# Altium schematic sheet vout.SchDoc: Vout
size A3; Author: wq; DrawnBy: wq; Organization: 合肥弗雷电子; Address1: 玉兰大道14号D栋3楼; Address2: 肥西县桃花镇; Address3: 合肥市; Address4: 安徽省; DocumentNumber: 1; Revision: betaV1.0; SheetNumber: 1; SheetTotal: 1
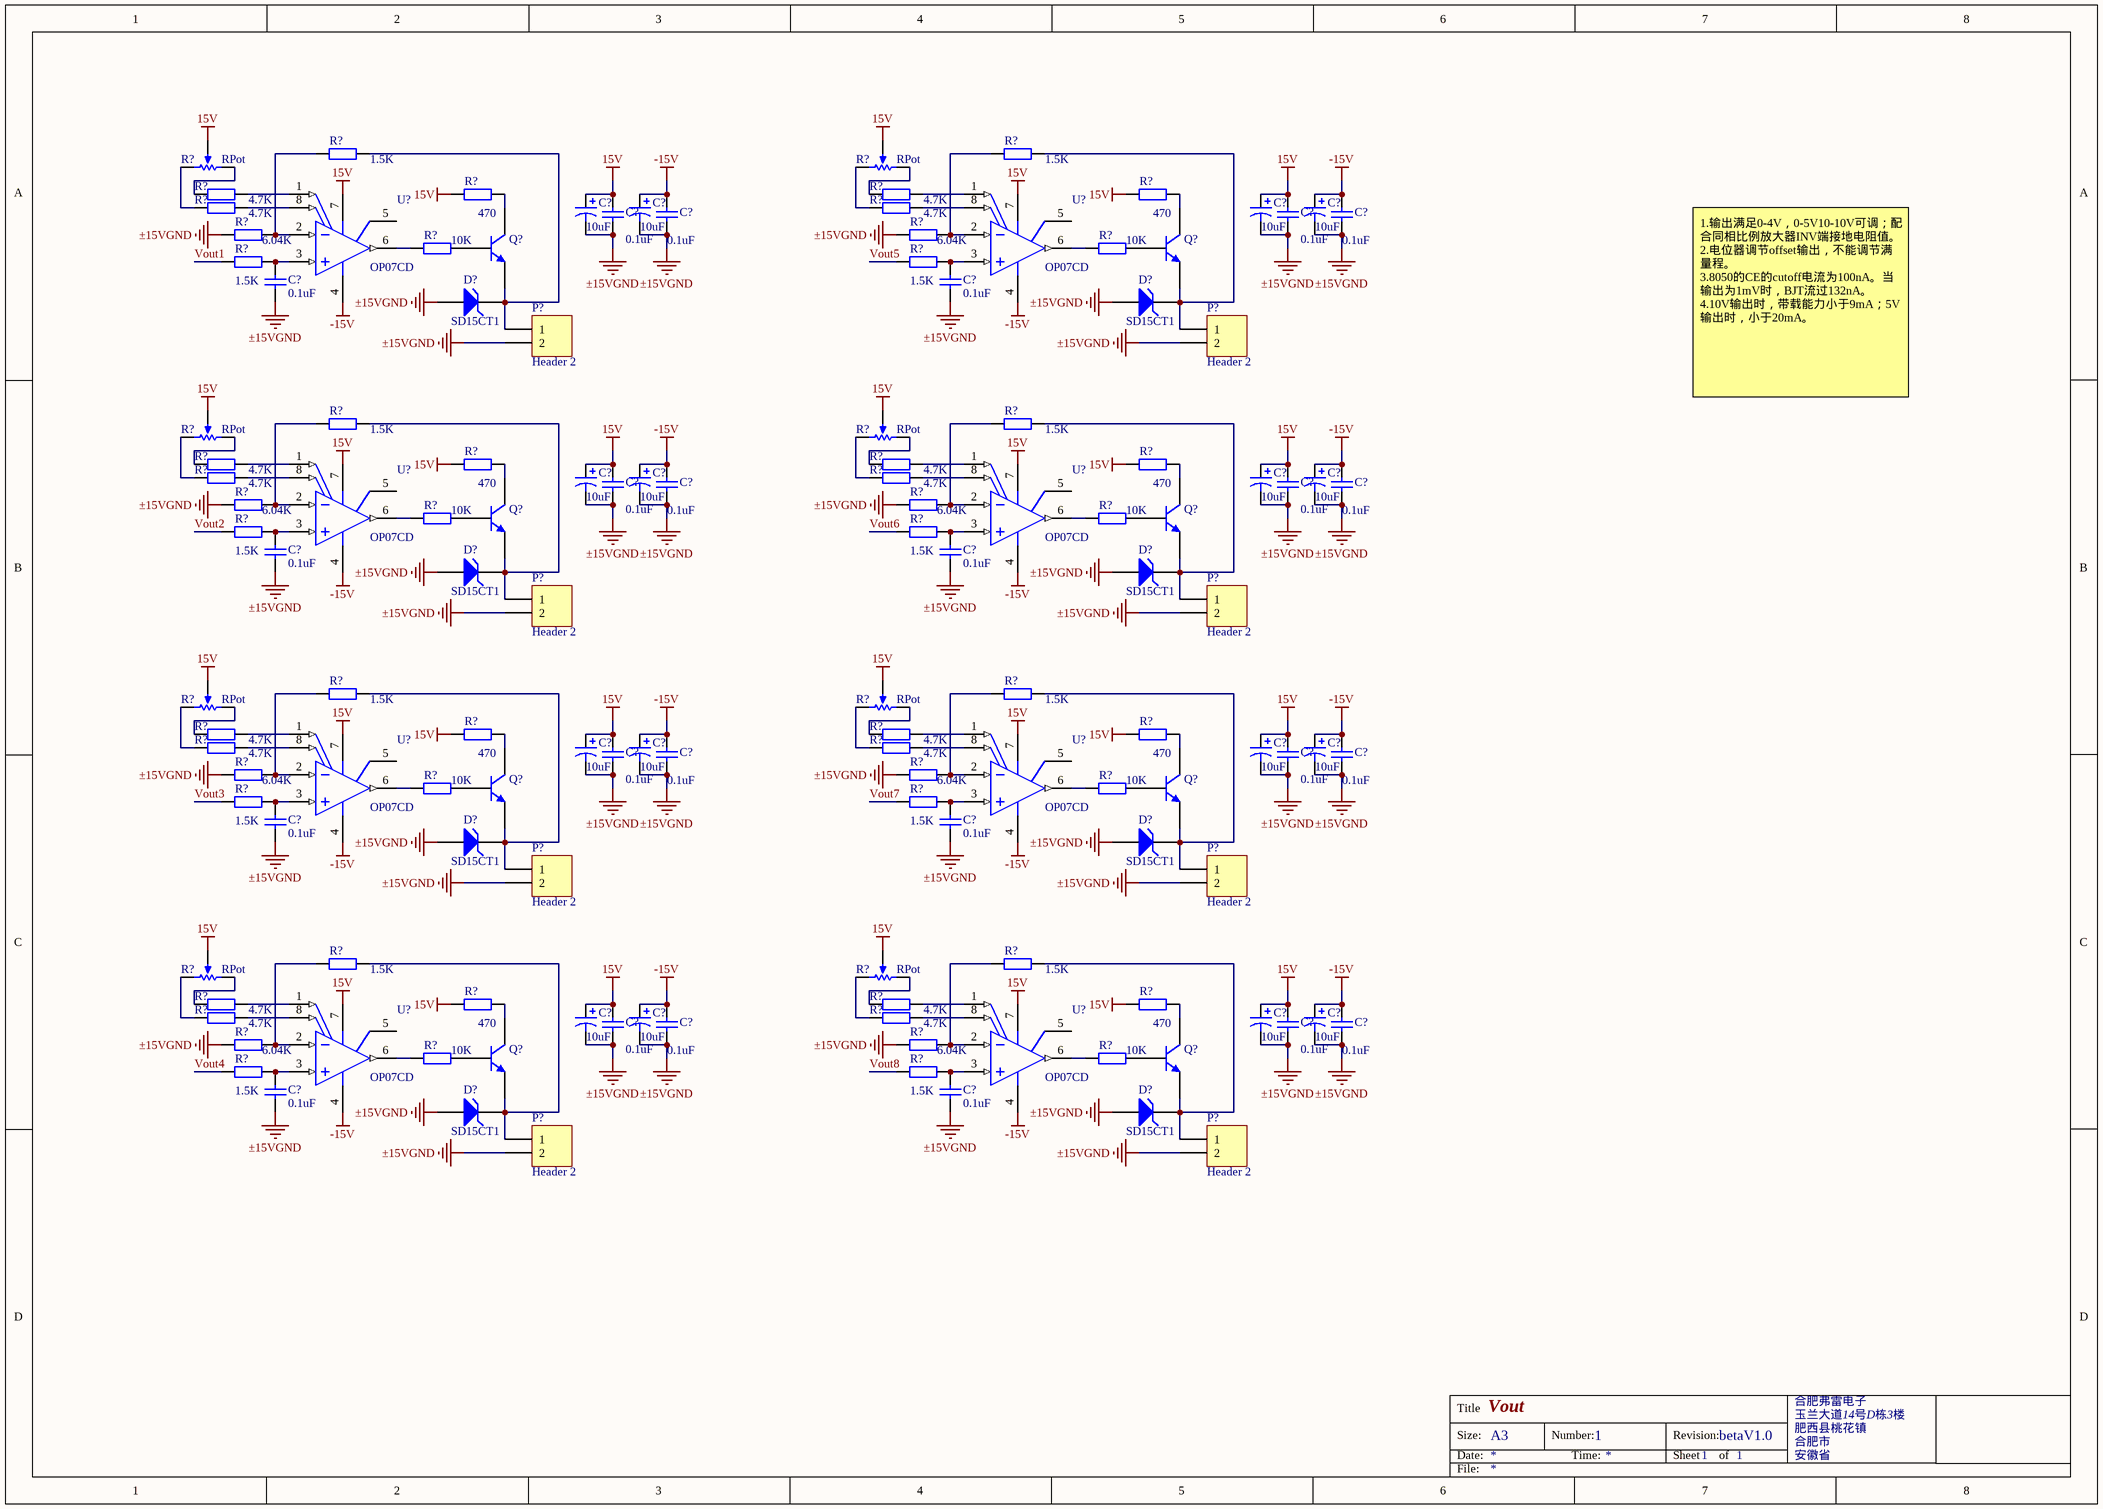
[diagram p0: vout.SchDoc]

## Parts
(Parts that share a designator on the sheet are numbered #1, #2 ... from top to bottom, then left to right.)
C?#1  value 10uF  [CB]  (hidden comment: T494B106M025AHAUTO)
C?#2  value 10uF  [CB]  (hidden comment: T494B106M025AHAUTO)
C?#3  value 10uF  [CB]  (hidden comment: T494B106M025AHAUTO)
C?#4  value 10uF  [CB]  (hidden comment: T494B106M025AHAUTO)
C?#5  value 0.1uF  [0805c]  (hidden comment: CC0805MRX7R9BB104)
C?#6  value 0.1uF  [0805c]  (hidden comment: CC0805MRX7R9BB104)
C?#7  value 0.1uF  [0805c]  (hidden comment: CC0805MRX7R9BB104)
C?#8  value 0.1uF  [0805c]  (hidden comment: CC0805MRX7R9BB104)
C?#9  value 0.1uF  [0805c]  (hidden comment: CC0805MRX7R9BB104)
C?#10  value 0.1uF  [0805c]  (hidden comment: CC0805MRX7R9BB104)
C?#11  value 10uF  [CB]  (hidden comment: T494B106M025AHAUTO)
C?#12  value 10uF  [CB]  (hidden comment: T494B106M025AHAUTO)
C?#13  value 10uF  [CB]  (hidden comment: T494B106M025AHAUTO)
C?#14  value 10uF  [CB]  (hidden comment: T494B106M025AHAUTO)
C?#15  value 0.1uF  [0805c]  (hidden comment: CC0805MRX7R9BB104)
C?#16  value 0.1uF  [0805c]  (hidden comment: CC0805MRX7R9BB104)
C?#17  value 0.1uF  [0805c]  (hidden comment: CC0805MRX7R9BB104)
C?#18  value 0.1uF  [0805c]  (hidden comment: CC0805MRX7R9BB104)
C?#19  value 0.1uF  [0805c]  (hidden comment: CC0805MRX7R9BB104)
C?#20  value 0.1uF  [0805c]  (hidden comment: CC0805MRX7R9BB104)
C?#21  value 10uF  [CB]  (hidden comment: T494B106M025AHAUTO)
C?#22  value 10uF  [CB]  (hidden comment: T494B106M025AHAUTO)
C?#23  value 10uF  [CB]  (hidden comment: T494B106M025AHAUTO)
C?#24  value 10uF  [CB]  (hidden comment: T494B106M025AHAUTO)
C?#25  value 0.1uF  [0805c]  (hidden comment: CC0805MRX7R9BB104)
C?#26  value 0.1uF  [0805c]  (hidden comment: CC0805MRX7R9BB104)
C?#27  value 0.1uF  [0805c]  (hidden comment: CC0805MRX7R9BB104)
C?#28  value 0.1uF  [0805c]  (hidden comment: CC0805MRX7R9BB104)
C?#29  value 0.1uF  [0805c]  (hidden comment: CC0805MRX7R9BB104)
C?#30  value 0.1uF  [0805c]  (hidden comment: CC0805MRX7R9BB104)
C?#31  value 10uF  [CB]  (hidden comment: T494B106M025AHAUTO)
C?#32  value 10uF  [CB]  (hidden comment: T494B106M025AHAUTO)
C?#33  value 10uF  [CB]  (hidden comment: T494B106M025AHAUTO)
C?#34  value 10uF  [CB]  (hidden comment: T494B106M025AHAUTO)
C?#35  value 0.1uF  [0805c]  (hidden comment: CC0805MRX7R9BB104)
C?#36  value 0.1uF  [0805c]  (hidden comment: CC0805MRX7R9BB104)
C?#37  value 0.1uF  [0805c]  (hidden comment: CC0805MRX7R9BB104)
C?#38  value 0.1uF  [0805c]  (hidden comment: CC0805MRX7R9BB104)
C?#39  value 0.1uF  [0805c]  (hidden comment: CC0805MRX7R9BB104)
C?#40  value 0.1uF  [0805c]  (hidden comment: CC0805MRX7R9BB104)
D?#1  SD15CT1  [sod323]
D?#2  SD15CT1  [sod323]
D?#3  SD15CT1  [sod323]
D?#4  SD15CT1  [sod323]
D?#5  SD15CT1  [sod323]
D?#6  SD15CT1  [sod323]
D?#7  SD15CT1  [sod323]
D?#8  SD15CT1  [sod323]
P?#1  Header 2  [HDR1X2]
P?#2  Header 2  [HDR1X2]
P?#3  Header 2  [HDR1X2]
P?#4  Header 2  [HDR1X2]
P?#5  Header 2  [HDR1X2]
P?#6  Header 2  [HDR1X2]
P?#7  Header 2  [HDR1X2]
P?#8  Header 2  [HDR1X2]
Q?#1  MMSS8050  [SOT-23-BJT]  (value not drawn)
Q?#2  MMSS8050  [SOT-23-BJT]  (value not drawn)
Q?#3  MMSS8050  [SOT-23-BJT]  (value not drawn)
Q?#4  MMSS8050  [SOT-23-BJT]  (value not drawn)
Q?#5  MMSS8050  [SOT-23-BJT]  (value not drawn)
Q?#6  MMSS8050  [SOT-23-BJT]  (value not drawn)
Q?#7  MMSS8050  [SOT-23-BJT]  (value not drawn)
Q?#8  MMSS8050  [SOT-23-BJT]  (value not drawn)
R?#1  RPot  [VR5]
R?#2  RPot  [VR5]
R?#3  value 1.5K  [0805R]  (hidden comment: RC0805JR-072KL)
R?#4  value 1.5K  [0805R]  (hidden comment: RC0805JR-072KL)
R?#5  value 470  [0805R]  (hidden comment: RC0805JR-07470RL)
R?#6  value 470  [0805R]  (hidden comment: RC0805JR-07470RL)
R?#7  value 4.7K  [0805R]  (hidden comment: RC0805JR-074700RL)
R?#8  value 4.7K  [0805R]  (hidden comment: RC0805JR-074700RL)
R?#9  value 4.7K  [0805R]  (hidden comment: RC0805JR-074700RL)
R?#10  value 4.7K  [0805R]  (hidden comment: RC0805JR-074700RL)
R?#11  value 6.04K  [0805R]  (hidden comment: RC0805JR-072KL)
R?#12  value 6.04K  [0805R]  (hidden comment: RC0805JR-072KL)
R?#13  value 10K  [0805R]  (hidden comment: RC0805JR-0710KL)
R?#14  value 10K  [0805R]  (hidden comment: RC0805JR-0710KL)
R?#15  value 1.5K  [0805R]  (hidden comment: RC0805JR-072KL)
R?#16  value 1.5K  [0805R]  (hidden comment: RC0805JR-072KL)
R?#17  RPot  [VR5]
R?#18  RPot  [VR5]
R?#19  value 1.5K  [0805R]  (hidden comment: RC0805JR-072KL)
R?#20  value 1.5K  [0805R]  (hidden comment: RC0805JR-072KL)
R?#21  value 470  [0805R]  (hidden comment: RC0805JR-07470RL)
R?#22  value 470  [0805R]  (hidden comment: RC0805JR-07470RL)
R?#23  value 4.7K  [0805R]  (hidden comment: RC0805JR-074700RL)
R?#24  value 4.7K  [0805R]  (hidden comment: RC0805JR-074700RL)
R?#25  value 4.7K  [0805R]  (hidden comment: RC0805JR-074700RL)
R?#26  value 4.7K  [0805R]  (hidden comment: RC0805JR-074700RL)
R?#27  value 6.04K  [0805R]  (hidden comment: RC0805JR-072KL)
R?#28  value 6.04K  [0805R]  (hidden comment: RC0805JR-072KL)
R?#29  value 10K  [0805R]  (hidden comment: RC0805JR-0710KL)
R?#30  value 10K  [0805R]  (hidden comment: RC0805JR-0710KL)
R?#31  value 1.5K  [0805R]  (hidden comment: RC0805JR-072KL)
R?#32  value 1.5K  [0805R]  (hidden comment: RC0805JR-072KL)
R?#33  RPot  [VR5]
R?#34  RPot  [VR5]
R?#35  value 1.5K  [0805R]  (hidden comment: RC0805JR-072KL)
R?#36  value 1.5K  [0805R]  (hidden comment: RC0805JR-072KL)
R?#37  value 470  [0805R]  (hidden comment: RC0805JR-07470RL)
R?#38  value 470  [0805R]  (hidden comment: RC0805JR-07470RL)
R?#39  value 4.7K  [0805R]  (hidden comment: RC0805JR-074700RL)
R?#40  value 4.7K  [0805R]  (hidden comment: RC0805JR-074700RL)
R?#41  value 4.7K  [0805R]  (hidden comment: RC0805JR-074700RL)
R?#42  value 4.7K  [0805R]  (hidden comment: RC0805JR-074700RL)
R?#43  value 6.04K  [0805R]  (hidden comment: RC0805JR-072KL)
R?#44  value 6.04K  [0805R]  (hidden comment: RC0805JR-072KL)
R?#45  value 10K  [0805R]  (hidden comment: RC0805JR-0710KL)
R?#46  value 10K  [0805R]  (hidden comment: RC0805JR-0710KL)
R?#47  value 1.5K  [0805R]  (hidden comment: RC0805JR-072KL)
R?#48  value 1.5K  [0805R]  (hidden comment: RC0805JR-072KL)
R?#49  RPot  [VR5]
R?#50  RPot  [VR5]
R?#51  value 1.5K  [0805R]  (hidden comment: RC0805JR-072KL)
R?#52  value 1.5K  [0805R]  (hidden comment: RC0805JR-072KL)
R?#53  value 470  [0805R]  (hidden comment: RC0805JR-07470RL)
R?#54  value 470  [0805R]  (hidden comment: RC0805JR-07470RL)
R?#55  value 4.7K  [0805R]  (hidden comment: RC0805JR-074700RL)
R?#56  value 4.7K  [0805R]  (hidden comment: RC0805JR-074700RL)
R?#57  value 4.7K  [0805R]  (hidden comment: RC0805JR-074700RL)
R?#58  value 4.7K  [0805R]  (hidden comment: RC0805JR-074700RL)
R?#59  value 6.04K  [0805R]  (hidden comment: RC0805JR-072KL)
R?#60  value 6.04K  [0805R]  (hidden comment: RC0805JR-072KL)
R?#61  value 10K  [0805R]  (hidden comment: RC0805JR-0710KL)
R?#62  value 10K  [0805R]  (hidden comment: RC0805JR-0710KL)
R?#63  value 1.5K  [0805R]  (hidden comment: RC0805JR-072KL)
R?#64  value 1.5K  [0805R]  (hidden comment: RC0805JR-072KL)
U?#1  OP07CD  [TI-D8_N]
U?#2  OP07CD  [TI-D8_N]
U?#3  OP07CD  [TI-D8_N]
U?#4  OP07CD  [TI-D8_N]
U?#5  OP07CD  [TI-D8_N]
U?#6  OP07CD  [TI-D8_N]
U?#7  OP07CD  [TI-D8_N]
U?#8  OP07CD  [TI-D8_N]

## Nets
15V: C?#1.1 C?#3.1 C?#5.2 C?#7.2 C?#11.1 C?#13.1 C?#15.2 C?#17.2 C?#21.1 C?#23.1 C?#25.2 C?#27.2 C?#31.1 C?#33.1 C?#35.2 C?#37.2 R?#1.2(TAP) R?#2.2(TAP) R?#5.1 R?#6.1 R?#17.2(TAP) R?#18.2(TAP) R?#21.1 R?#22.1 R?#33.2(TAP) R?#34.2(TAP) R?#37.1 R?#38.1 R?#49.2(TAP) R?#50.2(TAP) R?#53.1 R?#54.1 U?#1.7(VCC+) U?#2.7(VCC+) U?#3.7(VCC+) U?#4.7(VCC+) U?#5.7(VCC+) U?#6.7(VCC+) U?#7.7(VCC+) U?#8.7(VCC+)
-15V: C?#2.1 C?#4.1 C?#6.2 C?#8.2 C?#12.1 C?#14.1 C?#16.2 C?#18.2 C?#22.1 C?#24.1 C?#26.2 C?#28.2 C?#32.1 C?#34.1 C?#36.2 C?#38.2 U?#1.4(VCC-) U?#2.4(VCC-) U?#3.4(VCC-) U?#4.4(VCC-) U?#5.4(VCC-) U?#6.4(VCC-) U?#7.4(VCC-) U?#8.4(VCC-)
±15VGND: C?#1.2 C?#2.2 C?#3.2 C?#4.2 C?#5.1 C?#6.1 C?#7.1 C?#8.1 C?#9.2 C?#10.2 C?#11.2 C?#12.2 C?#13.2 C?#14.2 C?#15.1 C?#16.1 C?#17.1 C?#18.1 C?#19.2 C?#20.2 C?#21.2 C?#22.2 C?#23.2 C?#24.2 C?#25.1 C?#26.1 C?#27.1 C?#28.1 C?#29.2 C?#30.2 C?#31.2 C?#32.2 C?#33.2 C?#34.2 C?#35.1 C?#36.1 C?#37.1 C?#38.1 C?#39.2 C?#40.2 D?#1.1(A) D?#2.1(A) D?#3.1(A) D?#4.1(A) D?#5.1(A) D?#6.1(A) D?#7.1(A) D?#8.1(A) P?#1.2 P?#2.2 P?#3.2 P?#4.2 P?#5.2 P?#6.2 P?#7.2 P?#8.2 R?#11.2 R?#12.2 R?#27.2 R?#28.2 R?#43.2 R?#44.2 R?#59.2 R?#60.2
Vout1: R?#15.2
Vout2: R?#31.2
Vout3: R?#47.2
Vout4: R?#63.2
Vout5: R?#16.2
Vout6: R?#32.2
Vout7: R?#48.2
Vout8: R?#64.2
NetC?#9_1: C?#9.1 R?#15.1 U?#1.3(IN+)
NetC?#10_1: C?#10.1 R?#16.1 U?#2.3(IN+)
NetC?#19_1: C?#19.1 R?#31.1 U?#3.3(IN+)
NetC?#20_1: C?#20.1 R?#32.1 U?#4.3(IN+)
NetC?#29_1: C?#29.1 R?#47.1 U?#5.3(IN+)
NetC?#30_1: C?#30.1 R?#48.1 U?#6.3(IN+)
NetC?#39_1: C?#39.1 R?#63.1 U?#7.3(IN+)
NetC?#40_1: C?#40.1 R?#64.1 U?#8.3(IN+)
NetD?#1_2: D?#1.2(K) P?#1.1 Q?#1.3(E) R?#3.1
NetD?#2_2: D?#2.2(K) P?#2.1 Q?#2.3(E) R?#4.1
NetD?#3_2: D?#3.2(K) P?#3.1 Q?#3.3(E) R?#19.1
NetD?#4_2: D?#4.2(K) P?#4.1 Q?#4.3(E) R?#20.1
NetD?#5_2: D?#5.2(K) P?#5.1 Q?#5.3(E) R?#35.1
NetD?#6_2: D?#6.2(K) P?#6.1 Q?#6.3(E) R?#36.1
NetD?#7_2: D?#7.2(K) P?#7.1 Q?#7.3(E) R?#51.1
NetD?#8_2: D?#8.2(K) P?#8.1 Q?#8.3(E) R?#52.1
NetQ?#1_1: Q?#1.1(C) R?#5.2
NetQ?#1_2: Q?#1.2(B) R?#13.1
NetQ?#2_1: Q?#2.1(C) R?#6.2
NetQ?#2_2: Q?#2.2(B) R?#14.1
NetQ?#3_1: Q?#3.1(C) R?#21.2
NetQ?#3_2: Q?#3.2(B) R?#29.1
NetQ?#4_1: Q?#4.1(C) R?#22.2
NetQ?#4_2: Q?#4.2(B) R?#30.1
NetQ?#5_1: Q?#5.1(C) R?#37.2
NetQ?#5_2: Q?#5.2(B) R?#45.1
NetQ?#6_1: Q?#6.1(C) R?#38.2
NetQ?#6_2: Q?#6.2(B) R?#46.1
NetQ?#7_1: Q?#7.1(C) R?#53.2
NetQ?#7_2: Q?#7.2(B) R?#61.1
NetQ?#8_1: Q?#8.1(C) R?#54.2
NetQ?#8_2: Q?#8.2(B) R?#62.1
NetR?#1_1: R?#1.1(BOT) R?#9.2
NetR?#1_3: R?#1.3(TOP) R?#7.2
NetR?#2_1: R?#2.1(BOT) R?#10.2
NetR?#2_3: R?#2.3(TOP) R?#8.2
NetR?#3_2: R?#3.2 R?#11.1 U?#1.2(IN-)
NetR?#4_2: R?#4.2 R?#12.1 U?#2.2(IN-)
NetR?#7_1: R?#7.1 U?#1.1(OFFSET_N1)
NetR?#8_1: R?#8.1 U?#2.1(OFFSET_N1)
NetR?#9_1: R?#9.1 U?#1.8(OFFSET_N2)
NetR?#10_1: R?#10.1 U?#2.8(OFFSET_N2)
NetR?#13_2: R?#13.2 U?#1.6(OUT)
NetR?#14_2: R?#14.2 U?#2.6(OUT)
NetR?#17_1: R?#17.1(BOT) R?#25.2
NetR?#17_3: R?#17.3(TOP) R?#23.2
NetR?#18_1: R?#18.1(BOT) R?#26.2
NetR?#18_3: R?#18.3(TOP) R?#24.2
NetR?#19_2: R?#19.2 R?#27.1 U?#3.2(IN-)
NetR?#20_2: R?#20.2 R?#28.1 U?#4.2(IN-)
NetR?#23_1: R?#23.1 U?#3.1(OFFSET_N1)
NetR?#24_1: R?#24.1 U?#4.1(OFFSET_N1)
NetR?#25_1: R?#25.1 U?#3.8(OFFSET_N2)
NetR?#26_1: R?#26.1 U?#4.8(OFFSET_N2)
NetR?#29_2: R?#29.2 U?#3.6(OUT)
NetR?#30_2: R?#30.2 U?#4.6(OUT)
NetR?#33_1: R?#33.1(BOT) R?#41.2
NetR?#33_3: R?#33.3(TOP) R?#39.2
NetR?#34_1: R?#34.1(BOT) R?#42.2
NetR?#34_3: R?#34.3(TOP) R?#40.2
NetR?#35_2: R?#35.2 R?#43.1 U?#5.2(IN-)
NetR?#36_2: R?#36.2 R?#44.1 U?#6.2(IN-)
NetR?#39_1: R?#39.1 U?#5.1(OFFSET_N1)
NetR?#40_1: R?#40.1 U?#6.1(OFFSET_N1)
NetR?#41_1: R?#41.1 U?#5.8(OFFSET_N2)
NetR?#42_1: R?#42.1 U?#6.8(OFFSET_N2)
NetR?#45_2: R?#45.2 U?#5.6(OUT)
NetR?#46_2: R?#46.2 U?#6.6(OUT)
NetR?#49_1: R?#49.1(BOT) R?#57.2
NetR?#49_3: R?#49.3(TOP) R?#55.2
NetR?#50_1: R?#50.1(BOT) R?#58.2
NetR?#50_3: R?#50.3(TOP) R?#56.2
NetR?#51_2: R?#51.2 R?#59.1 U?#7.2(IN-)
NetR?#52_2: R?#52.2 R?#60.1 U?#8.2(IN-)
NetR?#55_1: R?#55.1 U?#7.1(OFFSET_N1)
NetR?#56_1: R?#56.1 U?#8.1(OFFSET_N1)
NetR?#57_1: R?#57.1 U?#7.8(OFFSET_N2)
NetR?#58_1: R?#58.1 U?#8.8(OFFSET_N2)
NetR?#61_2: R?#61.2 U?#7.6(OUT)
NetR?#62_2: R?#62.2 U?#8.6(OUT)

Not connected (* = marked no-connect by the designer): U?#1 5(NC); U?#2 5(NC); U?#3 5(NC); U?#4 5(NC); U?#5 5(NC); U?#6 5(NC); U?#7 5(NC); U?#8 5(NC)

## Notes on the sheet
- 1.输出满足0-4V，0-5V10-10V可调；配合同相比例放大器INV端接地电阻值。
  2.电位器调节offset输出，不能调节满量程。
  3.8050的CE的cutoff电流为100nA。当输出为1mV时，BJT流过132nA。
  4.10V输出时，带载能力小于9mA；5V输出时，小于20mA。
- Title
- Size:
- Date:
- A3
- Number:
- Time:
- Revision:
- Sheet
- of
- File:

## Library data of the parts
C?#1-C?#4 C?#11-C?#14 C?#21-C?#24 C?#31-C?#34 = Cap Pol1: Polarized Capacitor (Radial); Published: 8-Jun-2000; LatestRevisionDate: 17-Jul-2002; LatestRevisionNote: Re-released for DXP Platform.; PackageReference: RB7.6-15; Publisher: Altium Limited; PackageDescription: Polarized Capacitor (Radial); 2 Leads
C?#5-C?#10 C?#15-C?#20 C?#25-C?#30 C?#35-C?#40 = Cap: Capacitor; Published: 8-Jun-2000; LatestRevisionDate: 17-Jul-2002; LatestRevisionNote: Re-released for DXP Platform.; PackageReference: RAD-0.3; Publisher: Altium Limited; PackageDescription: Radial Cap, Thru-Hole; 2 Leads; 0.3 in Pin Spacing
D?#1-D?#8 = D Zener: Zener Diode; Published: 8-Jun-2000; LatestRevisionDate: 17-Jul-2002; LatestRevisionNote: Re-released for DXP Platform.; PackageReference: DIODE-0.7; Publisher: Altium Limited; PackageDescription: Diode, Thru-Hole; 2 Leads; 0.7 in Pin Spacing
P?#1-P?#8 = Header 2: Header, 2-Pin; LatestRevisionDate: 17-Jul-2002; LatestRevisionNote: Re-released for DXP Platform.; Publisher: Altium Limited
Q?#1-Q?#8 = NPN: NPN Bipolar Transistor; Published: 8-Jun-2000; LatestRevisionDate: 17-Jul-2002; LatestRevisionNote: Re-released for DXP Platform.; PackageReference: TO-226-AA; Publisher: Altium Limited; PackageDescription: TO, Flat Index; 3 In-Line, Axial Leads; Body Dia. 4.8mm; Leads 0.55 x 0.51 mm (max); Code_JEDEC: TO-226-AA
R?#1 R?#2 R?#17 R?#18 R?#33 R?#34 R?#49 R?#50 = RPot: Potentiometer; Sim Note: Enter the Resistance value and the set point into parameter fields.; Set Position: 0.5; Value: 1K; Published: 8-Jun-2000; LatestRevisionDate: 17-Jul-2002; LatestRevisionNote: Re-released for DXP Platform.; PackageReference: VR5; Publisher: Altium Limited; PackageDescription: Variable Resistor, Thru-Hole; 3 Leads
R?#3-R?#16 R?#19-R?#32 R?#35-R?#48 R?#51-R?#64 = Res2: Resistor; Published: 8-Jun-2000; LatestRevisionDate: 17-Jul-2002; LatestRevisionNote: Re-released for DXP Platform.; PackageReference: AXIAL-0.4; Publisher: Altium Limited; PackageDescription: Axial Device, Thru-Hole; 2 Leads; 0.4 in Pin Spacing
U?#1-U?#8 = OP07CD: Low-Offset Voltage Operational Amplifier, 6 to 36 V, 0 to 70 degC, 8-pin SOIC (D8), Green (RoHS & no Sb/Br); Manufacturer: Texas Instruments; CMRR(Min)(dB): 100; GBW(Typ)(MHz): 0.6; IIB(Max)(pA): 7000; Iq per channel(Max)(mA): 5; Number of Channels: 1; Offset Drift(Typ)(uV/C): 0.5; Rating: Catalog; Slew Rate(Typ)(V/us): 0.3; Sub Family: General Purpose Amplifier, High Supply Voltage Amplifier (>=30V), Low Noise Amp (<=10nV/rtHz), Low Offset Voltage Amplifier (<=500uV); Total Supply Voltage(Max)(+5V is 5, +/-5V is 10): 36; Total Supply Voltage(Min)(+5V is 5, +/-5V is 10): 6; Vio (25C)(Max)(mV): 0.15; Vn at 1kHz(Typ)(nV/rtHz): 9.8; DatasheetVersion: SLOS099E; PackageVersion: 4040047-3/M, 06/2011; PackageReference: D8; PackageDescription: 8-Pin Plastic Small Outline, Body 4.9 x 3.9 mm, Pitch 1.27 mm; Supplier 1: Digi-Key; Supplier Part Number 1: 296-12852-5-ND; Supplier 2: Farnell; Supplier Part Number 2: 9589929; Supplier 3: Newark; Supplier Part Number 3: 67K2808; Supplier 4: Mouser; Supplier Part Number 4: 595-OP07CD; Eco-Plan: Green (RoHS & no Sb/Br); Mounting Technology: Surface Mount; Code_JEDEC: MS-012; PartNumber: OP07CD; ComponentLink1Description: Manufacturer URL; ComponentLink1URL: http://www.ti.com/; ComponentLink2Description: Datasheet; ComponentLink2URL: http://www.ti.com/lit/ds/symlink/op07c.pdf; ComponentLink3Description: Package Specification; ComponentLink3URL: http://www.ti.com/litv/pdf/msoi002j